# Altium schematic sheet 模拟火灾报警装置 - 原理图.SchDoc
size A4
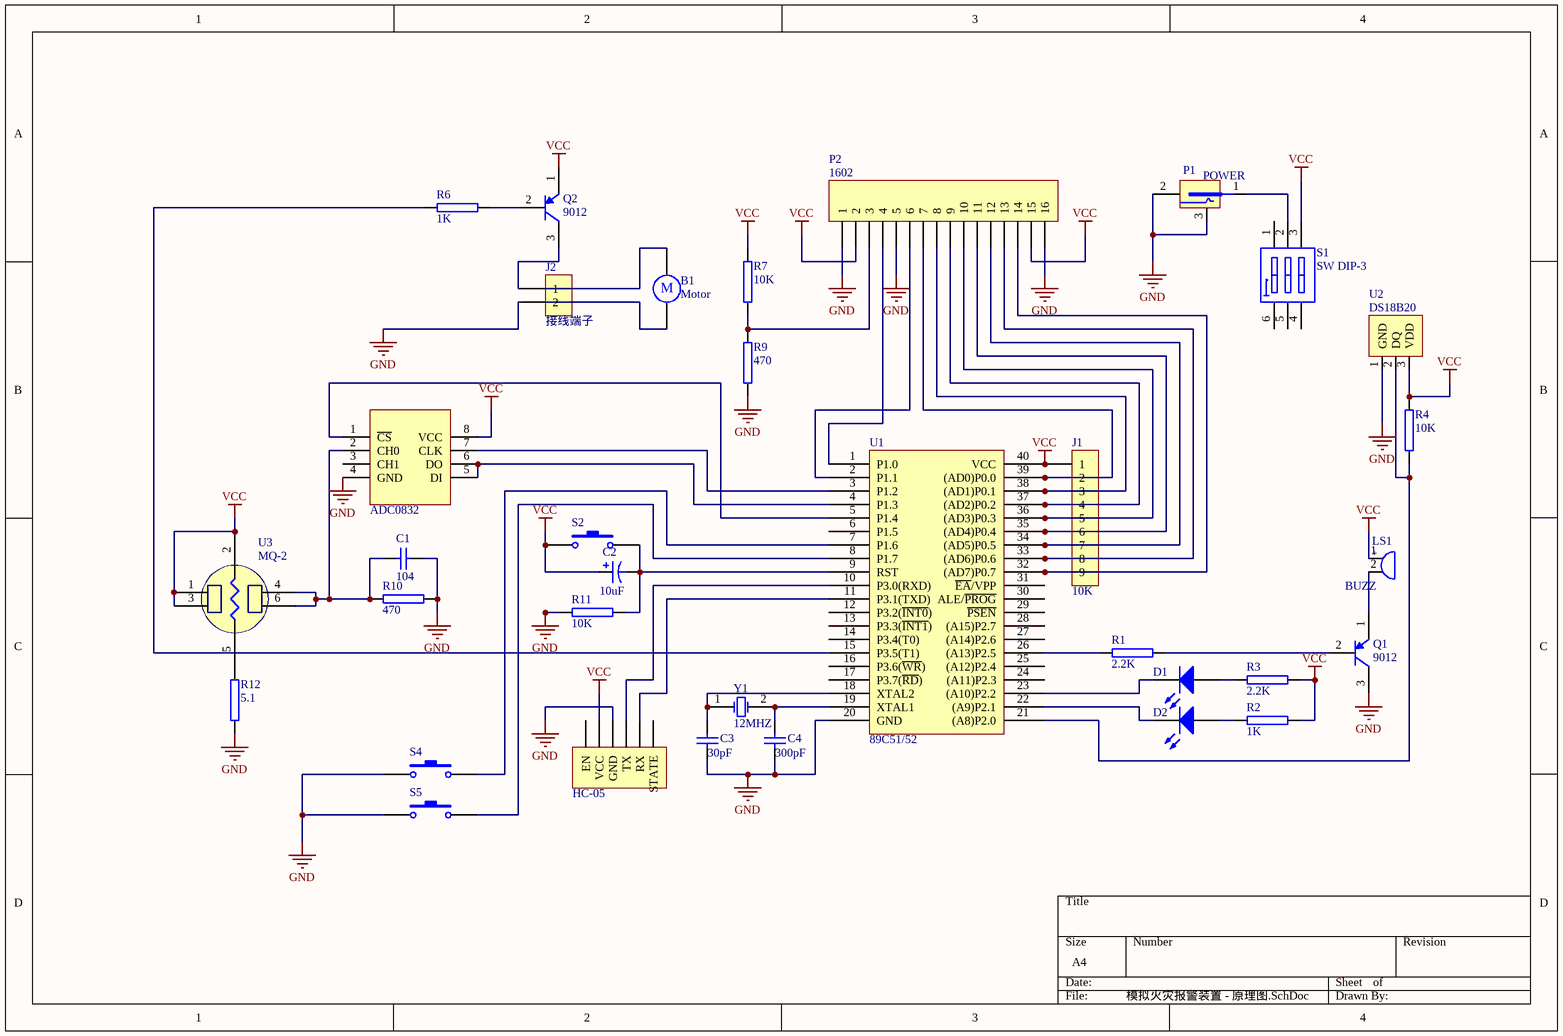
[diagram p0: 模拟火灾报警装置 - 原理图.SchDoc]

## Parts
?  ADC0832  [N08E]
B1  Motor  [RB5-10.5]
C1  value 104  [CAP-0.1]  (hidden comment: Cap)
C2  value 10uF  [CAPPR1.5-4X5]  (hidden comment: Cap Pol1)
C3  value 30pF  [CAP-0.1]  (hidden comment: Cap)
C4  value 300pF  [CAP-0.1]  (hidden comment: Cap)
D1  LED1  [DIODE-0.3]  (value not drawn)
D2  LED2  [DIODE-0.3]  (value not drawn)
HC-05  Header 6H  [HDR1X6H]  (value not drawn)
J1  10K  [PIN-9-2.54-1.0]
J2  接线端子  [SIP-2]
LS1  BUZZ  [BUZZER_12*9.5]
P1  POWER  [7257-3]
P2  1602  [HDR1X16]
Q1  9012  [TO-92(TO-92-3)]
Q2  9012  [TO-92(TO-92-3)]
R1  2.2K  [AXIAL-0.3]
R2  1K  [AXIAL-0.3]
R3  2.2K  [AXIAL-0.3]
R4  10K  [AXIAL-0.3]
R6  1K  [AXIAL-0.3]
R7  10K  [AXIAL-0.3]
R9  470  [AXIAL-0.3]
R10  470  [AXIAL-0.3]
R11  10K  [AXIAL-0.3]
R12  5.1  [AXIAL-0.3]
S1  SW DIP-3  [DIP-6]
S2  Tactile Switch  [BUTTON_6*6]  (value not drawn)
S4  Tactile Switch  [BUTTON_6*6]  (value not drawn)
S5  Tactile Switch  [BUTTON_6*6]  (value not drawn)
U1  89C51/52  [dip40 - 紧缩座]
U2  DS18B20  [TO-92]
U3  MQ-2  [MQ-2]
Y1  12MHZ  [R38]

## Nets
GND: ?.4(GND) C1.1 C3.1 C4.1 HC-05.3(GND) J2.2 P1.2 P1.3 P2.1 P2.5 P2.16 Q1.3(C) R9.1 R10.2 R11.1 R12.1 S4.1 S5.1 U1.20(GND) U2.1(GND)
VCC: ?.8(VCC) C2.1 HC-05.2(VCC) J1.1 LS1.1 P2.2 P2.15 Q2.1(E) R2.2 R3.2 R4.2 R7.2 S1.3(A3) S2.1 U1.40(VCC) U2.3(VDD) U3.1 U3.2 U3.3
Net?_1: ?.1(~{CS}) U1.5(P1.4)
Net?_2: ?.2(CH0) C1.2 R10.1 U3.4 U3.6
Net?_5: ?.5(DI) ?.6(DO) U1.4(P1.3)
Net?_7: ?.7(CLK) U1.3(P1.2)
NetC2_2: C2.2 R11.2 S2.2 U1.9(RST)
NetC3_2: C3.2 U1.18(XTAL2) Y1.1(OSC1)
NetC4_2: C4.2 U1.19(XTAL1) Y1.2(OSC2)
NetD1_1: D1.1(A) R3.1
NetD1_2: D1.2(K) U1.23((A10)P2.2)
NetD2_1: D2.1(A) R2.1
NetD2_2: D2.2(K) U1.22((A9)P2.1)
NetHC-05_4: HC-05.4(TX) U1.10(P3.0(RXD))
NetHC-05_5: HC-05.5(RX) U1.11(P3.1(TXD))
NetJ1_2: J1.2 P2.7 U1.39((AD0)P0.0)
NetJ1_3: J1.3 P2.8 U1.38((AD1)P0.1)
NetJ1_4: J1.4 P2.9 U1.37((AD2)P0.2)
NetJ1_5: J1.5 P2.10 U1.36((AD3)P0.3)
NetJ1_6: J1.6 P2.11 U1.35((AD4)P0.4)
NetJ1_7: J1.7 P2.12 U1.34((AD5)P0.5)
NetJ1_8: J1.8 P2.13 U1.33((AD6)P0.6)
NetJ1_9: J1.9 P2.14 U1.32((AD7)P0.7)
NetJ2_1: J2.1 Q2.3(C)
NetLS1_2: LS1.2 Q1.1(E)
NetP1_1: P1.1 S1.2(A2)
NetP2_3: P2.3 R7.1 R9.2
NetP2_4: P2.4 U1.1(P1.0)
NetP2_6: P2.6 U1.2(P1.1)
NetQ1_2: Q1.2(B) R1.2
NetQ2_2: Q2.2(B) R6.2
NetR1_1: R1.1 U1.26((A13)P2.5)
NetR4_1: R4.1 U1.21((A8)P2.0) U2.2(DQ)
NetR6_1: R6.1 U1.15(P3.5(T1))
NetR12_2: R12.2 U3.5
NetS4_2: S4.2 U1.7(P1.6)
NetS5_2: S5.2 U1.8(P1.7)

Not connected (* = marked no-connect by the designer): ? 3(CH1); B1 1 2; HC-05 1(EN) 6(STATE); S1 1(A1) 4(B3) 5(B2) 6(B1); U1 6(P1.5) 12(P3.2(~{INT0})) 13(P3.3(~{INT1})) 14(P3.4(T0)) 16(P3.6(~{WR})) 17(P3.7(~{RD})) 24((A11)P2.3) 25((A12)P2.4) 27((A14)P2.6) 28((A15)P2.7) 29(~{PSEN}) 30(ALE/~{PROG}) 31(~{EA}/VPP)

## Notes on the sheet
- (in symbol BUZZ) +
- (in symbol Motor) M

## Library data of the parts
B1 = Motor: Motor, General Kind; Published: 24-Mar-1999; LatestRevisionDate: 17-Jul-2002; LatestRevisionNote: Re-released for DXP Platform.; PackageReference: RB5-10.5; Publisher: Altium Limited; PackageDescription: Capacitor (Radial); 2 Leads
C1 C3 C4 = Cap: Capacitor; Published: 8-Jun-2000; LatestRevisionDate: 17-Jul-2002; LatestRevisionNote: Re-released for DXP Platform.; PackageReference: RAD-0.3; Publisher: Altium Limited; PackageDescription: Radial Cap, Thru-Hole; 2 Leads; 0.3 in Pin Spacing
C2 = Cap Pol1: Polarized Capacitor (Radial); Published: 8-Jun-2000; LatestRevisionDate: 17-Jul-2002; LatestRevisionNote: Re-released for DXP Platform.; PackageReference: RB7.6-15; Publisher: Altium Limited; PackageDescription: Polarized Capacitor (Radial); 2 Leads
D1 D2 = LED0: Typical INFRARED GaAs LED; Published: 8-Jun-2000; LatestRevisionDate: 08-Jul-2005; LatestRevisionNote: Mech Layer 1 removed.; PackageReference: LED-0; Publisher: Altium Limited; PackageDescription: LED; 2 Leads
HC-05 = Header 6H: Header, 6-Pin, Right Angle; LatestRevisionDate: 17-Jul-2002; LatestRevisionNote: Re-released for DXP Platform.; Publisher: Altium Limited
J1 = CON9: Connector
J2 = CON2: Connector
LS1 = BUZZ: 蜂鸣器
P2 = Header 16: Header, 16-Pin; LatestRevisionDate: 17-Jul-2002; LatestRevisionNote: Re-released for DXP Platform.; Publisher: Altium Limited
Q1 = 9012_TO-92: PNP型小功率三极管; datasheet: http://pdf1.alldatasheetcn.com/datasheet-pdf/view/311757/DAYA/9012.html
Q2 = 8550_TO-92: PNP型小功率三极管; HelpURL: https://baike.baidu.com/item/%E4%B8%89%E6%9E%81%E7%AE%A18550/862606
R1-R4 R6 R7 R9-R12 = R
S1 = SW DIP-3: DIP Switch, 3 Position, SPST; Published: 24-Mar-1999; LatestRevisionDate: 17-Jul-2002; LatestRevisionNote: Re-released for DXP Platform.; PackageReference: DIP-6; Publisher: Altium Limited; Code_JEDEC: MO-001-AM
S2 S4 S5 = SW-PB: Tactile Switch触觉开关; Published: 24-Mar-1999; LatestRevisionDate: 17-Jul-2002; LatestRevisionNote: Re-released for DXP Platform.; PackageReference: SPST-2; Publisher: Altium Limited
U1 = AT89C51
U3 = MQ-2: MQ-2 气体传感器
Y1 = XTAL: Crystal Oscillator; Published: 8-Jun-2000; LatestRevisionDate: 17-Jul-2002; LatestRevisionNote: Re-released for DXP Platform.; PackageReference: R38; Publisher: Altium Limited; PackageDescription: Crystal, Thru-Hole; 2 Leads; Body 3.1 x 8.2 mm (Dia.xH)